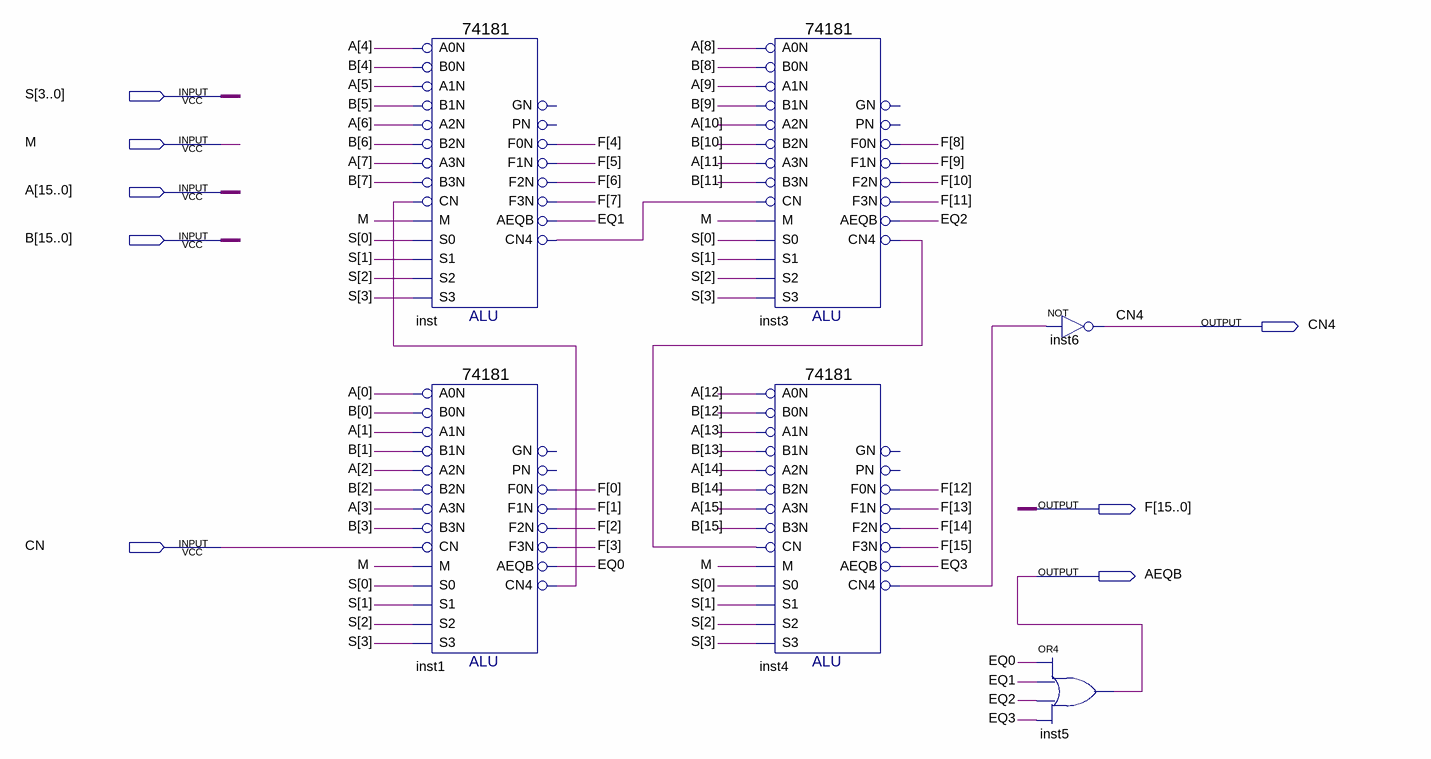
[diagram p0: schematic sheet]
// Quartus schematic ALU16.bdf as structural Verilog: 6 symbols, 8 pins
module ALU16 (
  input  [3:0] S,
  input  M,
  input  [15:0] A,
  input  [15:0] B,
  input  CN,
  output CN4,
  output [15:0] F,
  output AEQB
);

  wire EQ0, EQ1, EQ2, EQ3, inst1_cn4, inst3_cn4, inst4_cn4, inst_cn4;

  \74181  inst (
    .B0N(B[4]), .A0N(A[4]), .A1N(A[5]), .B1N(B[5]), .A3N(A[7]), .B2N(B[6]), .A2N(A[6]), .M(M),
    .CN(inst1_cn4), .B3N(B[7]), .S2(S[2]), .S1(S[1]), .S0(S[0]), .S3(S[3]), .F3N(F[7]), .F1N(F[5]),
    .F0N(F[4]), .AEQB(EQ1), .CN4(inst_cn4), .F2N(F[6]));  // open: PN, GN
  \74181  inst1 (
    .B0N(B[0]), .A0N(A[0]), .A1N(A[1]), .B1N(B[1]), .A3N(A[3]), .B2N(B[2]), .A2N(A[2]), .M(M), .CN(CN),
    .B3N(B[3]), .S2(S[2]), .S1(S[1]), .S0(S[0]), .S3(S[3]), .F3N(F[3]), .F1N(F[1]), .F0N(F[0]), .AEQB(EQ0),
    .CN4(inst1_cn4), .F2N(F[2]));  // open: PN, GN
  \74181  inst3 (
    .B0N(B[8]), .A0N(A[8]), .A1N(A[9]), .B1N(B[9]), .A3N(A[11]), .B2N(B[10]), .A2N(A[10]), .M(M),
    .CN(inst_cn4), .B3N(B[11]), .S2(S[2]), .S1(S[1]), .S0(S[0]), .S3(S[3]), .F3N(F[11]), .F1N(F[9]),
    .F0N(F[8]), .AEQB(EQ2), .CN4(inst3_cn4), .F2N(F[10]));  // open: PN, GN
  \74181  inst4 (
    .B0N(B[12]), .A0N(A[12]), .A1N(A[13]), .B1N(B[13]), .A3N(A[15]), .B2N(B[14]), .A2N(A[14]), .M(M),
    .CN(inst3_cn4), .B3N(B[15]), .S2(S[2]), .S1(S[1]), .S0(S[0]), .S3(S[3]), .F3N(F[15]), .F1N(F[13]),
    .F0N(F[12]), .AEQB(EQ3), .CN4(inst4_cn4), .F2N(F[14]));  // open: PN, GN
  not inst6 (CN4, inst4_cn4);
  or inst5 (AEQB, EQ0, EQ1, EQ2, EQ3);
endmodule
